# Altium schematic sheet Sterilise.SchDoc
size A
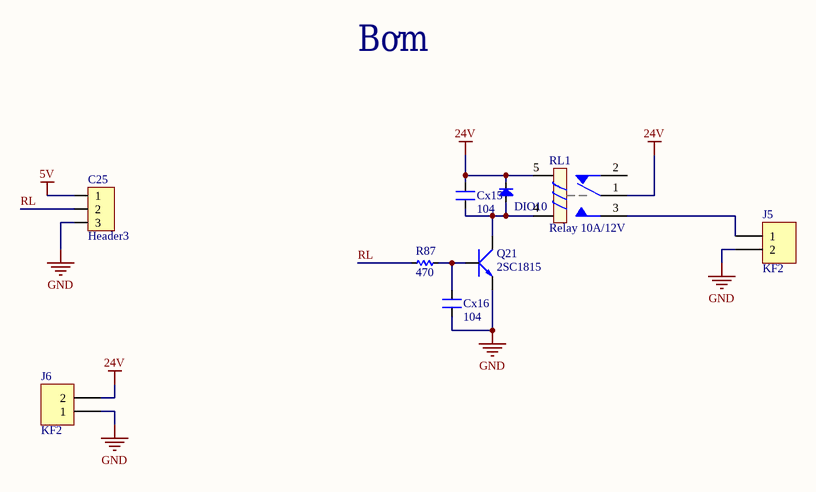
[diagram p0: Sterilise.SchDoc]

## Parts
C25  Header3  [Header3]
Cx15  104  [CN-SMD-0805]
Cx16  104  [CN-SMD-0805]
DIO10  Diode SMD  [DIO-SMD-106]  (value not drawn)
J5  KF2  [KF2-7.62]
J6  KF2  [KF2-7.62]
Q21  2SC1815  [SOT23-321]
R87  470  [RES-SMD-0805]
RL1  Relay 10A/12V  [RELAY 5]

## Nets
5V: C25.1
24V: Cx15.2 DIO10.2(K) J6.2 RL1.1 RL1.5
GND: C25.3 Cx16.1 J5.2 J6.1 Q21.1(E)
RL: C25.2 R87.2
NetCx15_1: Cx15.1 DIO10.1(A) Q21.2(C) RL1.4
NetCx16_2: Cx16.2 Q21.3(B) R87.1
NetJ5_1: J5.1 RL1.3

Not connected (* = marked no-connect by the designer): RL1 2

## Notes on the sheet
- Bơm

## Library data of the parts
C25 = Header3: Header IDC, 3 x 1 Pin Vertical 2.54mm Pitch (Non-Boxed, Male); Manufacturer: W¨¹rth Elektronik eiSos GmbH; partNo: 613002143121; ComponentLink1 Description: Manufacturer; ComponentLink2 Description: Datasheet; NoPins: 02; Created Date: 29 March 2013; ComponentLink1URL: http://www.we-online.com; ComponentLink2URL: http://katalog.we-online.de/em/datasheet/6130xx143121.pdf; Created by: Karrer Zheng
Cx15 Cx16 = CN: Value: 33pF
DIO10 = Diode SMD: Default Diode; Code - JEDEC: DO-214-AB; Value: 1N5007; Published: 8-Jun-2000; Revision: July-2002: Re-released for DXP Platform.; Publisher: Altium Limited
J5 J6 = KF2: Manufacturer: Würth Elektronik eiSos GmbH; partNo: 691103110002; ComponentLink1 Description: Manufacturer; ComponentLink2 Description: Datasheet; NoPins: 2; Created Date: 29 October 2013; ComponentLink1URL: http://www.we-online.com; ComponentLink2URL: http://katalog.we-online.de/em/datasheet/6911031100xx.pdf; Created by: Karrer Zheng
Q21 = 2SC1815: NPN 600mW, ECB; Value: C1815
R87 = Res-SMD: Resistor; Manufacturer: Generic Components; Class: Passive; Published: 08/06/2000; Publisher: Altium Hobart Technology Centre
RL1 = Relay 5: Relay SPDT,10A - 12VDC 5 Pin; Value: Relay SPDT, 10A, 12V